# EAGLE schematic untitled (EAGLE 9.6.1)
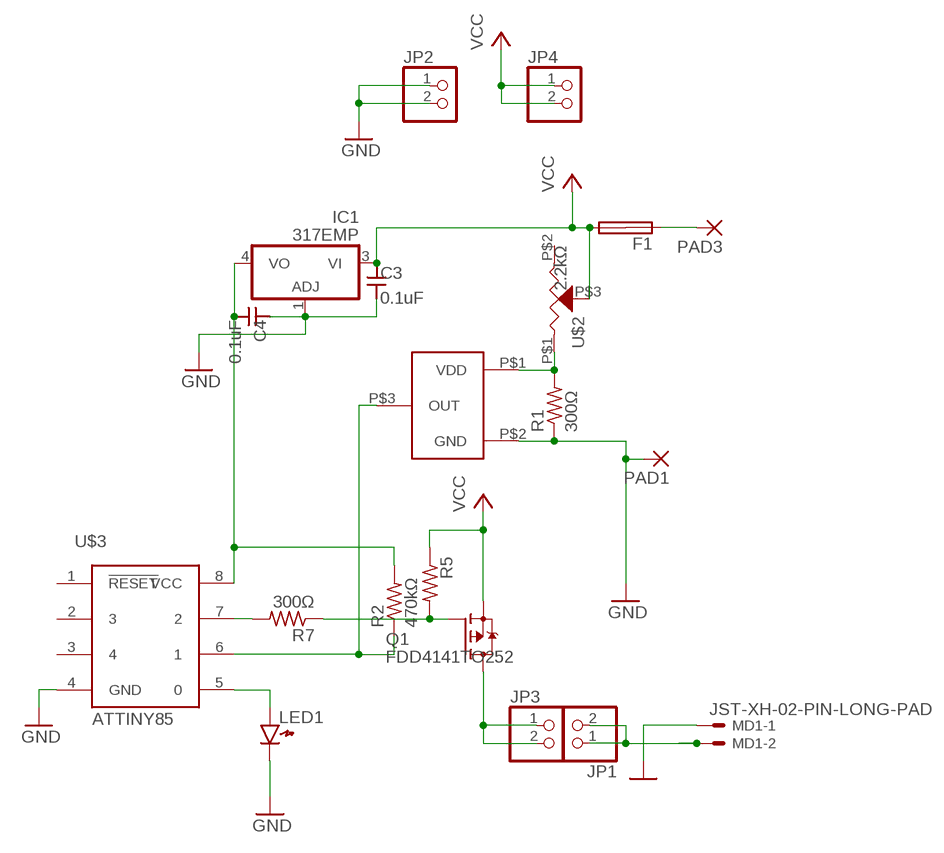
[diagram p0: schematic, sheet 1]

## Parts
C3  0.1uF  CAPACITOR1608  [SMD1608]
C4  0.1uF  CAPACITOR1608  [SMD1608]
F1  SH32  [SH32]
IC1  317EMP  [SOT223]
JP1  PINHD-1X2  [1X02]
JP2  PINHD-1X2  [1X02]
JP3  PINHD-1X2  [1X02]
JP4  PINHD-1X2  [1X02]
LED1  LED1608  [LED1608]
MD1  JST-XH-02-PIN-LONG-PAD  [JST-XH-02-PACKAGE-LONG-PAD]
PAD1  3,81/1,4  [3,81/1,4]
PAD3  3,81/1,4  [3,81/1,4]
Q1  FDD4141TO252  [TO252]
R1  300Ω  R-US_M2012  [M2012]
R2  470kΩ  R-US_M2012  [M2012]
R5  10k  R-US_M2012  [M2012]
R7  300Ω  R-US_M2012  [M2012]
U$1  R3111N211A  [R3111N211A]
U$2  2.2kΩ  SMD-R-TRIM  [SMD-R-TRIM]
U$3  ATTINY85  [8P3]

## Nets
GND: C3.2 C4.1 IC1.1(ADJ) JP2.1 JP2.2 LED1.K MD1.1 PAD1.1(P) R1.1 U$1.P$2(GND) U$3.4(GND)
N$1: R1.2 U$1.P$1(VDD) U$2.P$1
N$2: Q1.1(G) R5.2 R7.1
N$3: F1.1A PAD3.1(P)
N$4: R2.1 U$1.P$3(OUT) U$3.6
N$5: JP3.1 JP3.2 Q1.3(D)
N$6: LED1.A U$3.5
N$7: JP1.1 JP1.2 MD1.2
N$10: R7.2 U$3.7
N$11: C4.2 IC1.4(VO) R2.2 U$3.8(VCC)
VCC: C3.1 F1.2A IC1.3(VI) JP4.1 JP4.2 Q1.2(S) R5.1 U$2.P$3
Unconnected: F1.1B F1.2B U$2.P$2 U$3.1(!RESET) U$3.2 U$3.3

## Library data of the parts
C3 C4 = generic:CAPACITOR: Generic Capacitor
F1 = fuse:SH32: FUSE HOLDER 6 x 32 mm, SH contact, SHH3N Schukat, 102071 Wickmann (Buerklin); MPN: 10207101009; OC_FARNELL: 811786; OC_NEWARK: 76R6904
IC1 = linear:*317: Positive VOLTAGE REGULATOR
JP1-JP4 = pinhead:PINHD-1X2: PIN HEADER
LED1 = generic:LED: Generic LEDs
MD1 = Rembrandt Electronics - JST XH Connectors v1-0:JST-XH-02-PIN: JST XH Connector 2 Pin Wire to board connector. Pitch: 2,54 mm, (0.100") Number of pins: 2 Created by Rembrandt Electronics www.rembrandtelectronics.com
PAD1 PAD3 = wirepad:3,81/1,4: THROUGH-HOLE PAD
Q1 = transistor-fet:FDD4141: P-Channel PowerTrench® MOSFET Source: FDD4141.pdf
R1 R2 R5 R7 = adafruit:R-US_: RESISTOR, American symbol
U$1 = R3111N211A:R3111N211A
U$2 = by_hirame:SMD-R-TRIM
U$3 = attiny85:ATTINY85